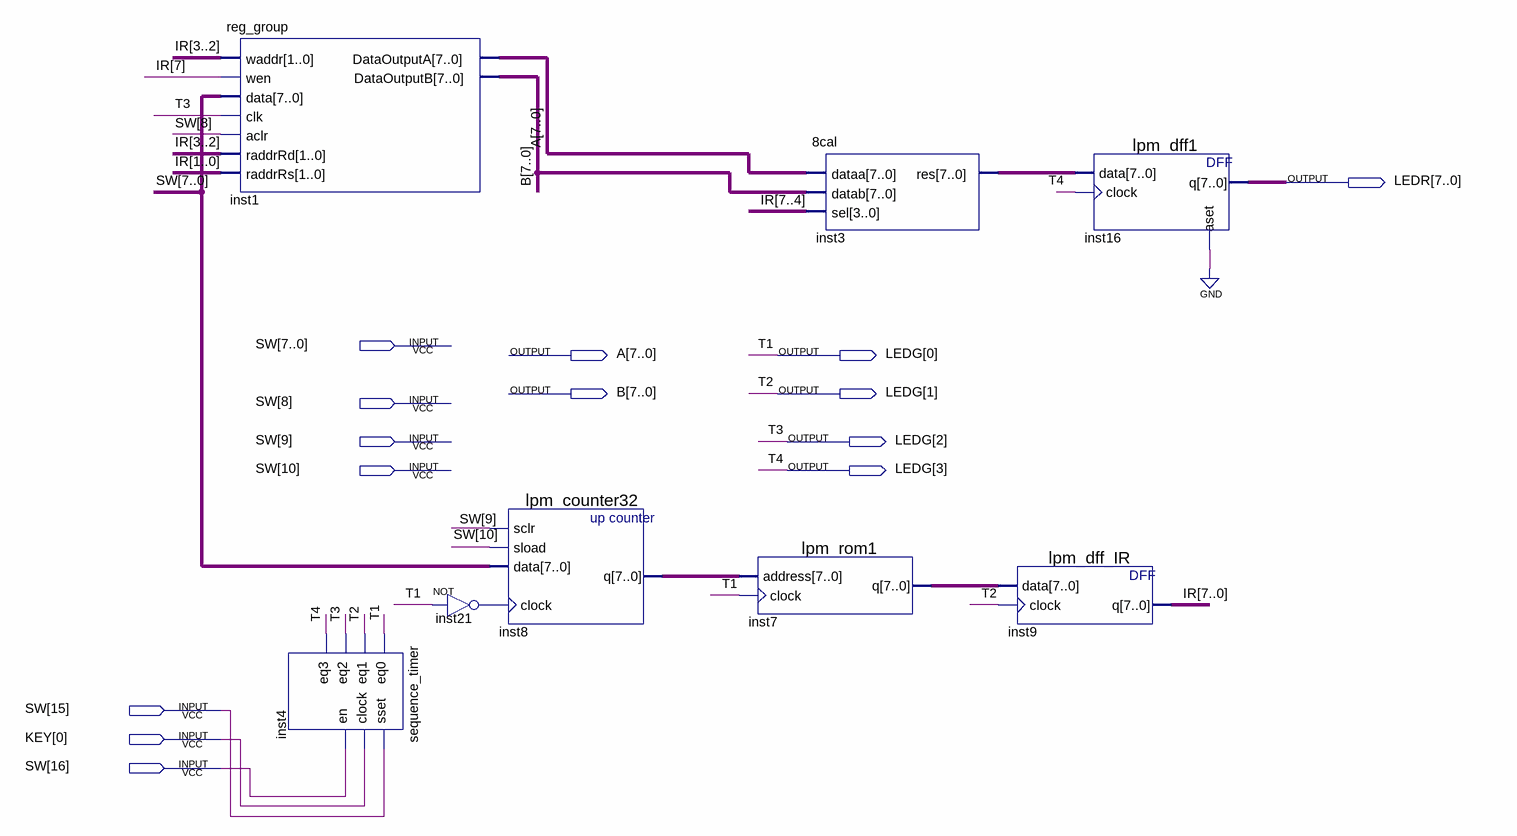
[diagram p0: schematic sheet]
// Quartus schematic cpu_8.bdf as structural Verilog: 8 symbols, 14 pins
module cpu_8 (
  input  [16:0] SW,
  input  [0:0] KEY,
  output [7:0] LEDR,
  output [7:0] A,
  output [3:0] LEDG,
  output [7:0] B
);

  wire inst21_out;
  wire [7:0] inst3_res, inst7_q, inst8_q, IR;

  reg_group inst1 (
    .waddr(IR[3:2]), .wen(IR[7]), .data(SW[7:0]), .clk(LEDG[2]), .aclr(SW[8]), .raddrRd(IR[3:2]),
    .raddrRs(IR[1:0]), .DataOutputA(A), .DataOutputB(B));
  sequence_timer inst4 (
    .sset(SW[15]), .clock(KEY[0]), .en(SW[16]), .eq0(LEDG[0]), .eq1(LEDG[1]), .eq2(LEDG[2]), .eq3(LEDG[3]));
  not inst21 (inst21_out, LEDG[0]);
  lpm_counter32 inst8 (.sclr(SW[9]), .sload(SW[10]), .data(SW[7:0]), .clock(inst21_out), .q(inst8_q));
  lpm_rom1 inst7 (.address(inst8_q), .clock(LEDG[0]), .q(inst7_q));
  \8cal  inst3 (.dataa(A), .datab(B), .sel(IR[7:4]), .res(inst3_res));
  lpm_dff_IR inst9 (.data(inst7_q), .clock(LEDG[1]), .q(IR));
  lpm_dff1 inst16 (.data(inst3_res), .clock(LEDG[3]), .aset(1'b0), .q(LEDR));

  // Other names for the same wires on the sheet: T1 = LEDG[0]; T2 = LEDG[1]; T3 = LEDG[2]; T4 = LEDG[3]
endmodule
